# EAGLE design ScanMasterVCI (EAGLE 9.5.2)

## Sheet 1 of 2: IC, Power, Connectors
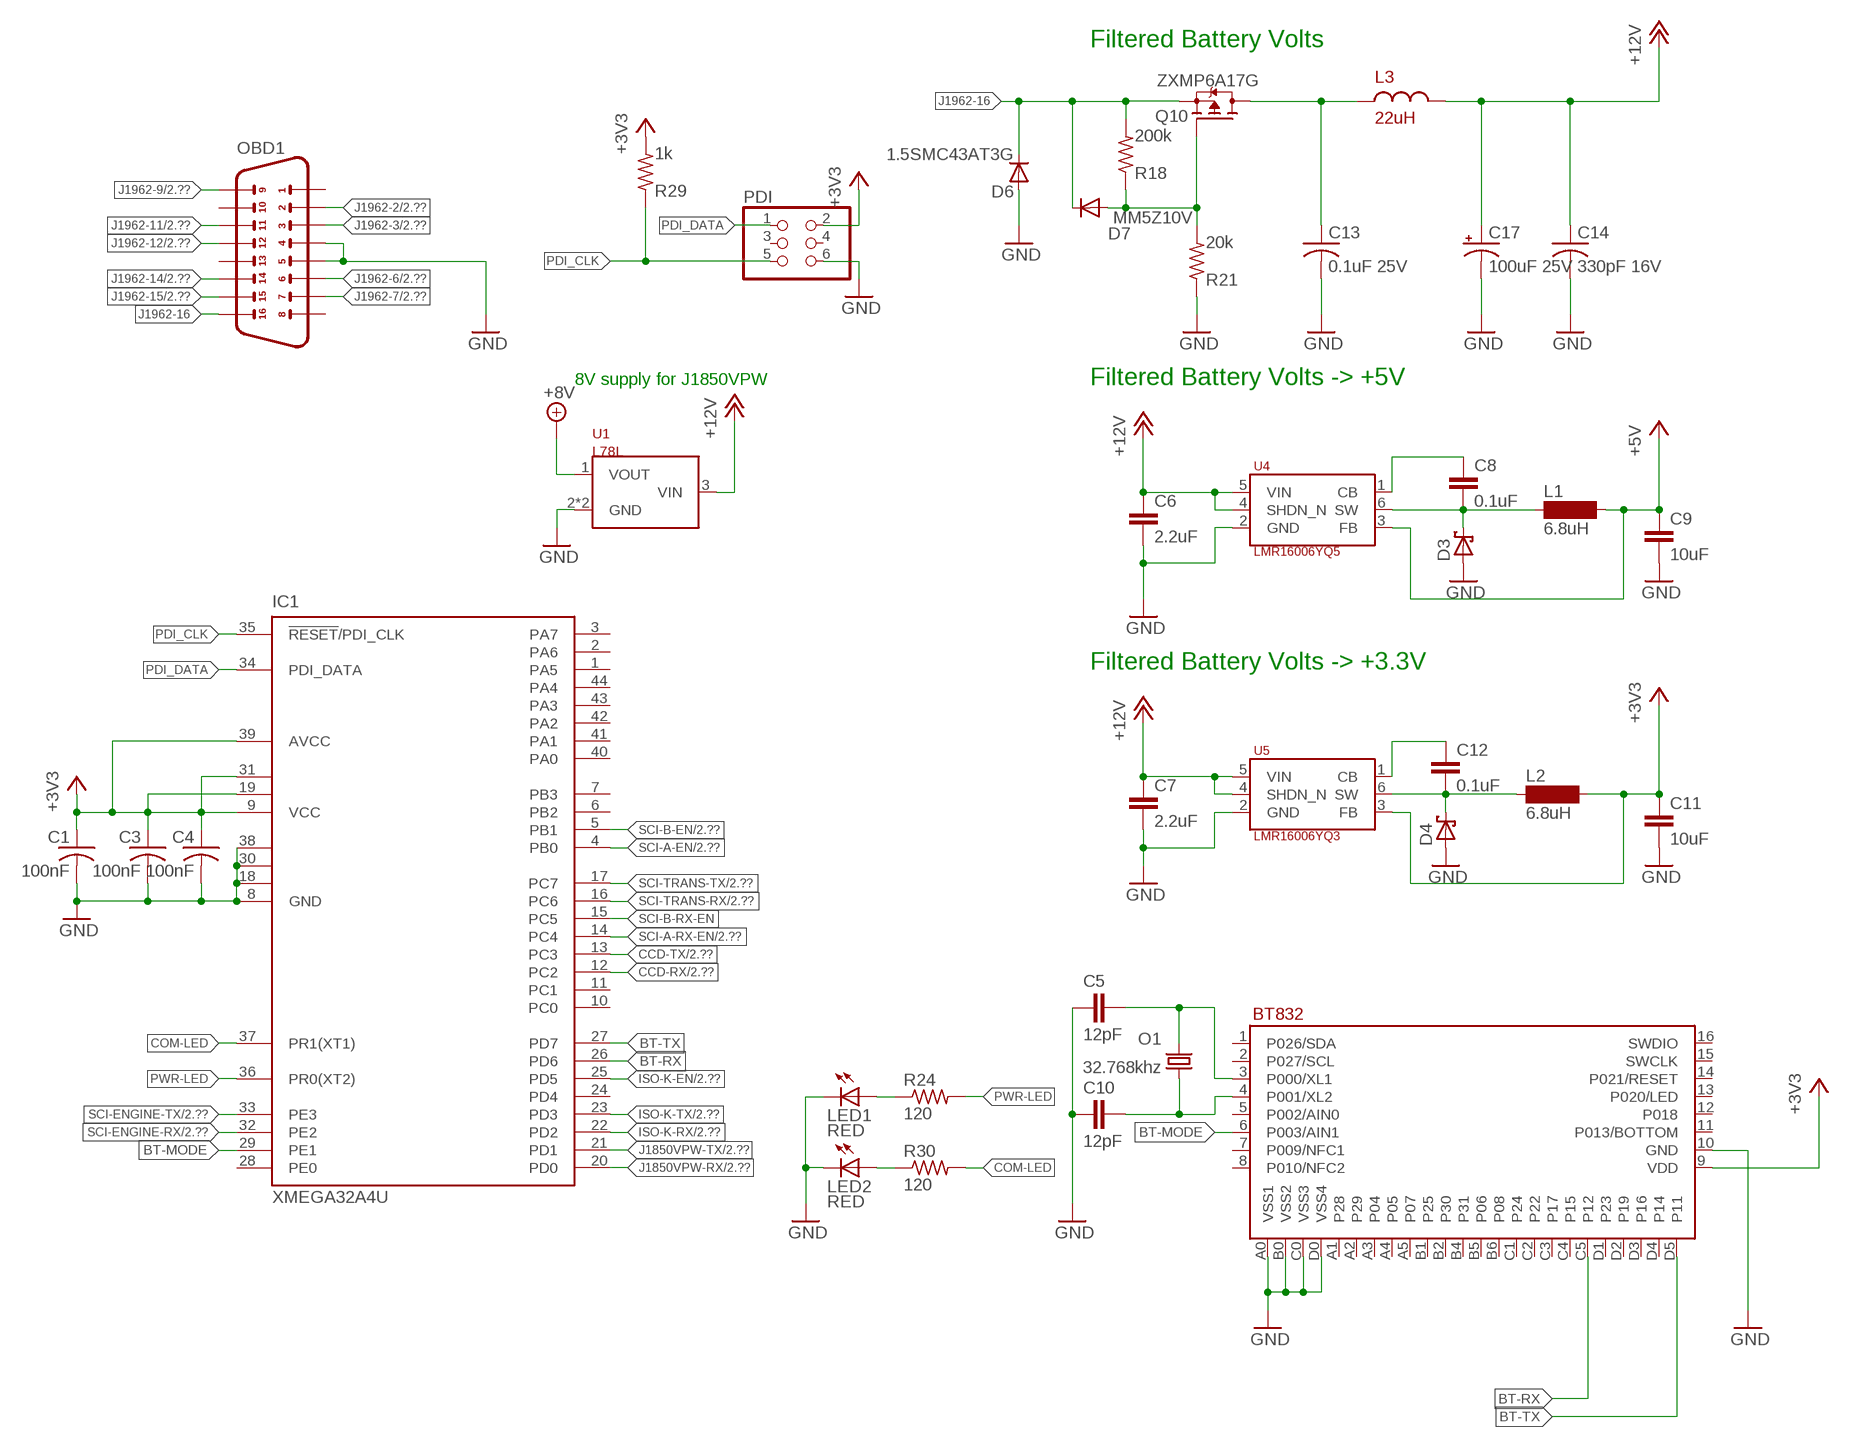
[diagram p0: schematic, sheet 1]

### Parts
C1  100nF  C-USC0402  [C0402]
C3  100nF  C-USC0402  [C0402]
C4  100nF  C-USC0402  [C0402]
C5  12pF  12PF-0603-50V-5%  [0603]
C6  2.2uF  2.2UF-1206-50V-10%  [1206]
C7  2.2uF  2.2UF-1206-50V-10%  [1206]
C8  0.1uF  0.1UF-0603-25V-(+80/-20%)  [0603]
C9  10uF  10UF-0603-6.3V-20%  [0603]
C10  12pF  12PF-0603-50V-5%  [0603]
C11  10uF  10UF-0603-6.3V-20%  [0603]
C12  0.1uF  0.1UF-0603-25V-(+80/-20%)  [0603]
C13  0.1uF 25V  C-USC0603  [C0603]
C14  330pF 16V  C-USC0603  [C0603]
C17  100uF 25V  100UF-POLAR-RADIAL-2.5MM-25V-20%  [CPOL-RADIAL-2.5MM-6.5MM]
D3  SM5817PL  [SOD123FL]
D4  SM5817PL  [SOD123FL]
D6  1.5SMC43AT3G  DIODE-SMC  [SMC]
D7  MM5Z10V  DIODE-SOD523  [SOD523]
IC1  XMEGA32A4U  XMEGA16A4M1  [MLF44-TH]
L1  6.8uH  SM-1206  [SM-1206]
L2  6.8uH  SM-1206  [SM-1206]
L3  22uH  INDUCTOR  [L0603]
LED1  RED  LEDCHIP-LED0603  [CHIP-LED0603]
LED2  RED  LEDCHIP-LED0603  [CHIP-LED0603]
O1  32.768khz  SER4103  [FC-135]
OBD1  OBD2_OBD2_90  [OBD2]
PDI  PINHD-2X3  [2X03]
Q10  ZXMP6A17G  [SOT223]
R18  200k  R-US_R0603  [R0603]
R21  20k  R-US_R0603  [R0603]
R24  120  R-US_R0603  [R0603]
R29  1k  R-US_R0603  [R0603]
R30  120  R-US_R0603  [R0603]
U1  L78L  [SOT89]
U4  LMR16006YQ5  LMR16006Y  [SOT6]
U5  LMR16006YQ3  LMR16006Y  [SOT6]
U6  BT832A  [BT832A]

### Nets
+3V3 [+3.3v]: C1.1 C3.1 C4.1 C11.1 IC1.9(VCC) IC1.19(VCC1) IC1.31(VCC2) IC1.39(AVCC) L2.2 PDI.2 R29.2 U5.3(FB) U6.9(VDD) ; also sheet 2
+5V [+5v]: C9.1 L1.2 U4.3(FB) ; also sheet 2
+8V [+3.3v]: U1.1(VOUT) ; also sheet 2
+12V [+12v]: C6.1 C7.1 C14.1 C17.1(+) L3.2 U1.3(VIN) U4.4(SHDN_N) U4.5(VIN) U5.4(SHDN_N) U5.5(VIN) ; also sheet 2
BT-MODE: IC1.29(PE1) U6.6(P003/AIN1)
BT-RX: IC1.26(PD6) U6.C5(P12)
BT-TX: IC1.27(PD7) U6.D5(P11)
CCD-RX: IC1.12(PC2) ; also sheet 2
CCD-TX: IC1.13(PC3) ; also sheet 2
COM-LED: IC1.37(PR1(XT1)) R30.2
GND [+12v]: C1.2 C3.2 C4.2 C5.1 C6.2 C7.2 C9.2 C10.1 C11.2 C13.2 C14.2 C17.2(-) D3.A D4.A D6.A IC1.8(GND) IC1.18(GND1) IC1.30(GND2) IC1.38(GND3) LED1.C LED2.C OBD1.4 OBD1.5 PDI.6 R21.1 U1.2(GND) U1.2@1(GND) U4.2(GND) U5.2(GND) U6.10(GND) U6.A0(VSS1) U6.B0(VSS2) U6.C0(VSS3) U6.D0(VSS4) ; also sheet 2
ISO-K-EN: IC1.25(PD5) ; also sheet 2
ISO-K-RX: IC1.22(PD2) ; also sheet 2
ISO-K-TX: IC1.23(PD3) ; also sheet 2
J1850VPW-RX: IC1.20(PD0) ; also sheet 2
J1850VPW-TX: IC1.21(PD1) ; also sheet 2
J1962-2: OBD1.2 ; also sheet 2
J1962-3: OBD1.3 ; also sheet 2
J1962-6: OBD1.6 ; also sheet 2
J1962-7: OBD1.7 ; also sheet 2
J1962-9: OBD1.9 ; also sheet 2
J1962-11: OBD1.11 ; also sheet 2
J1962-12: OBD1.12 ; also sheet 2
J1962-14: OBD1.14 ; also sheet 2
J1962-15: OBD1.15 ; also sheet 2
J1962-16 [+12v]: D6.C D7.C OBD1.16 Q10.3(S) R18.2
N$2: LED1.A R24.1
N$3: C8.1 U4.1(CB)
N$7: C8.2 D3.C L1.1 U4.6(SW)
N$9: C12.2 D4.C L2.1 U5.6(SW)
N$12: C12.1 U5.1(CB)
N$13: C5.2 O1.2 U6.3(P000/XL1)
N$18 [+12v]: C13.1 L3.1 Q10.2(D) Q10.4(D)
N$20 [+12v]: D7.A Q10.1(G) R18.1 R21.2
N$24: C10.2 O1.1 U6.4(P001/XL2)
N$27: LED2.A R30.1
PDI_CLK: IC1.35(!RESET!/PDI_CLK) PDI.5 R29.1
PDI_DATA: IC1.34(PDI_DATA) PDI.1
PWR-LED: IC1.36(PR0(XT2)) R24.2
SCI-A-EN: IC1.4(PB0) ; also sheet 2
SCI-A-RX-EN: IC1.14(PC4) ; also sheet 2
SCI-B-EN: IC1.5(PB1) ; also sheet 2
SCI-B-RX-EN: IC1.15(PC5)
SCI-ENGINE-RX: IC1.32(PE2) ; also sheet 2
SCI-ENGINE-TX: IC1.33(PE3) ; also sheet 2
SCI-TRANS-RX: IC1.16(PC6) ; also sheet 2
SCI-TRANS-TX: IC1.17(PC7) ; also sheet 2
Unconnected: IC1.1(PA5) IC1.2(PA6) IC1.3(PA7) IC1.6(PB2) IC1.7(PB3) IC1.10(PC0) IC1.11(PC1) IC1.24(PD4) IC1.28(PE0) IC1.40(PA0) IC1.41(PA1) IC1.42(PA2) IC1.43(PA3) IC1.44(PA4) OBD1.1 OBD1.8 OBD1.10 OBD1.13 PDI.3 PDI.4 U6.1(P026/SDA) U6.2(P027/SCL) U6.5(P002/AIN0) U6.7(P009/NFC1) U6.8(P010/NFC2) U6.11(P013/BOTTOM) U6.12(P018) U6.13(P020/LED) U6.14(P021/RESET) U6.15(SWCLK) U6.16(SWDIO) U6.A1(P28) U6.A2(P29) U6.A3(P04) U6.A4(P05) U6.A5(P07) U6.B1(P25) U6.B2(P30) U6.B4(P31) U6.B5(P06) U6.B6(P08) U6.C1(P24) U6.C2(P22) U6.C3(P17) U6.C4(P15) U6.D1(P23) U6.D2(P19) U6.D3(P16) U6.D4(P14)

### Notes on the sheet
- Filtered Battery Volts
- 8V supply for J1850VPW | Filtered Battery Volts -> +5V
- Filtered Battery Volts -> +3.3V

## Sheet 2 of 2: Bus Connections, Mux
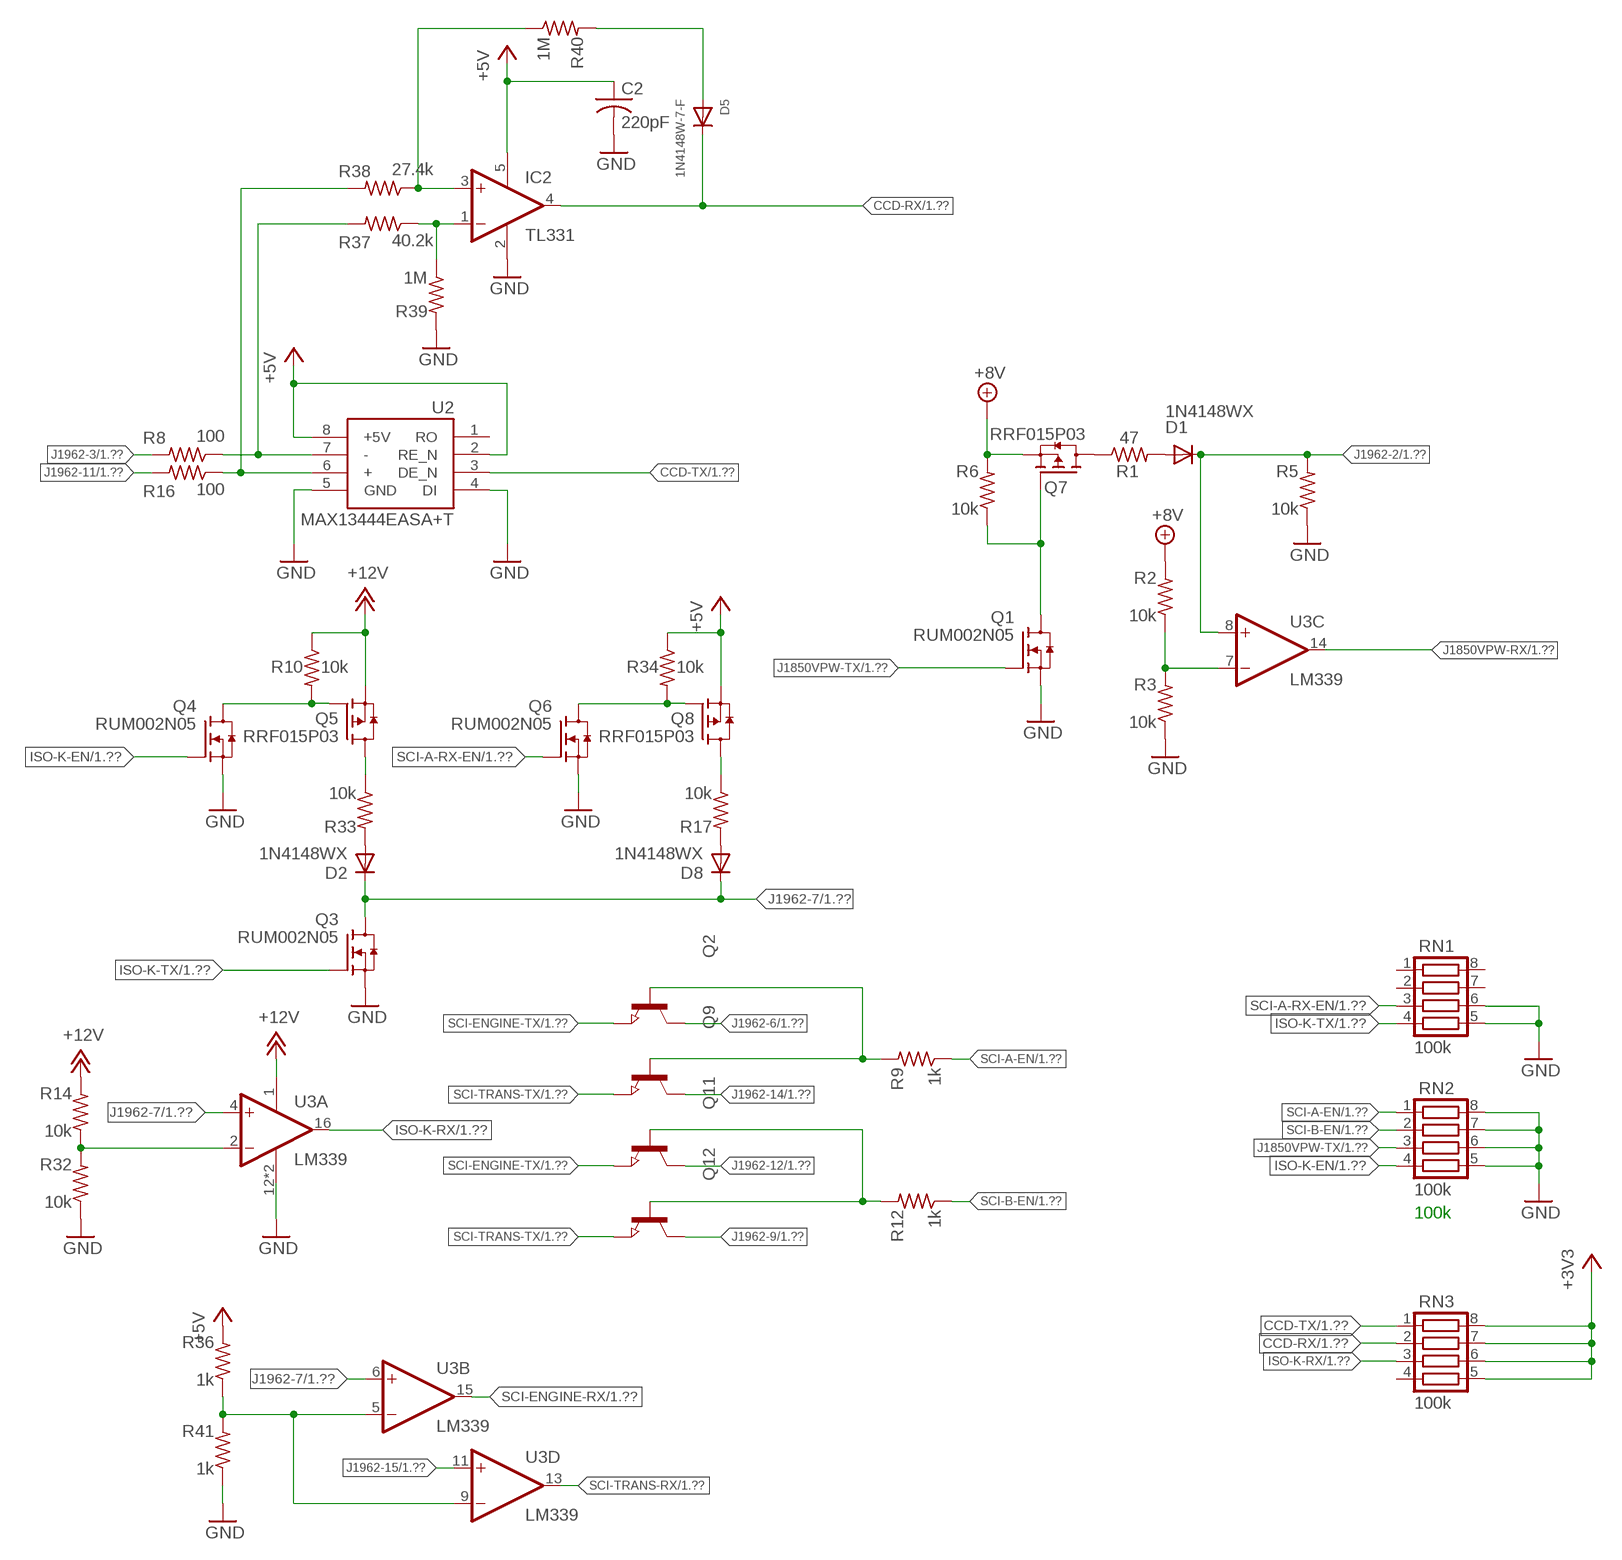
[diagram p1: schematic, sheet 2]

### Parts
C2  220pF  C-USC0603  [C0603]
D1  1N4148WX  DIODE-SOD323-R  [SOD323-R]
D2  1N4148WX  DIODE-SOD323-R  [SOD323-R]
D5  1N4148W-7-F  [SOD123FL]
D8  1N4148WX  DIODE-SOD323-R  [SOD323-R]
IC2  TL331  [DBV-R-PDSO-G5]
Q1  RUM002N05  [EMT3]
Q2  NPN-TRANSISTOR_SOT23  [SOT23]
Q3  RUM002N05  [EMT3]
Q4  RUM002N05  [EMT3]
Q5  RRF015P03  [SOT323]
Q6  RUM002N05  [EMT3]
Q7  RRF015P03  [SOT323]
Q8  RRF015P03  [SOT323]
Q9  NPN-TRANSISTOR_SOT23  [SOT23]
Q11  NPN-TRANSISTOR_SOT23  [SOT23]
Q12  NPN-TRANSISTOR_SOT23  [SOT23]
R1  47  R-US_R0603  [R0603]
R2  10k  R-US_R0603  [R0603]
R3  10k  R-US_R0603  [R0603]
R5  10k  R-US_R0603  [R0603]
R6  10k  R-US_R0603  [R0603]
R8  100  R-US_R0603  [R0603]
R9  1k  R-US_R0603  [R0603]
R10  10k  R-US_R0603  [R0603]
R12  1k  R-US_R0603  [R0603]
R14  10k  R-US_R0603  [R0603]
R16  100  R-US_R0603  [R0603]
R17  10k  R-US_R0603  [R0603]
R32  10k  R-US_R0603  [R0603]
R33  10k  R-US_R0603  [R0603]
R34  10k  R-US_R0603  [R0603]
R36  1k  R-US_R0603  [R0603]
R37  40.2k  R-US_R0603  [R0603]
R38  27.4k  R-US_R0603  [R0603]
R39  1M  R-US_R0603  [R0603]
R40  1M  R-US_R0603  [R0603]
R41  1k  R-US_R0603  [R0603]
RN1  100k  CTS742C083  [CTS742C083]
RN2  100k  CTS742C083  [CTS742C083]
RN3  100k  CTS742C083  [CTS742C083]
U2  MAX13444EASA+T  MAX13444EASA+SMD  [SO08]
U3  LM339  [QFN16]

### Nets
+3V3 [+3.3v]: RN3.5 RN3.6 RN3.7 RN3.8 ; also sheet 1
+5V [+5v]: C2.1 IC2.5(V+) Q8.2(S) R34.1 R36.2 U2.2(RE_N) U2.8(+5V) ; also sheet 1
+8V [+3.3v]: Q7.2(S) R2.2 R6.2 ; also sheet 1
+12V [+12v]: Q5.2(S) R10.1 R14.2 U3.1(A:V+) ; also sheet 1
CCD-RX: D5.C IC2.4(OUT) RN3.2 ; also sheet 1
CCD-TX: RN3.1 U2.3(DE_N) ; also sheet 1
GND [+12v]: C2.2 IC2.2(GND) Q1.2(S) Q3.2(S) Q4.2(S) Q6.2(S) R3.1 R5.1 R32.1 R39.2 R41.1 RN1.5 RN1.6 RN2.5 RN2.6 RN2.7 RN2.8 U2.4(DI) U2.5(GND) U3.12(A:V-) U3.PAD(A:V-) ; also sheet 1
ISO-K-EN: Q4.1(G) RN2.4 ; also sheet 1
ISO-K-RX: RN3.3 U3.16(A:OUT) ; also sheet 1
ISO-K-TX: Q3.1(G) RN1.4 ; also sheet 1
J1850VPW-RX: U3.14(C:OUT) ; also sheet 1
J1850VPW-TX: Q1.1(G) RN2.3 ; also sheet 1
J1962-2: D1.C R5.2 U3.8(C:+IN) ; also sheet 1
J1962-3: R8.2 ; also sheet 1
J1962-6: Q2.3(C) ; also sheet 1
J1962-7: D2.C D8.C Q3.3(D) U3.4(A:+IN) U3.6(B:+IN) ; also sheet 1
J1962-9: Q12.3(C) ; also sheet 1
J1962-11: R16.2 ; also sheet 1
J1962-12: Q11.3(C) ; also sheet 1
J1962-14: Q9.3(C) ; also sheet 1
J1962-15: U3.11(D:+IN) ; also sheet 1
N$1: Q2.1(B) Q9.1(B) R9.2
N$4: Q4.3(D) Q5.1(G) R10.2
N$5: Q11.1(B) Q12.1(B) R12.2
N$6: R36.1 R41.2 U3.5(B:-IN) U3.9(D:-IN)
N$8: R14.1 R32.2 U3.2(A:-IN)
N$10: Q7.3(D) R1.1
N$11: D2.A R33.2
N$21: D8.A R17.2
N$22: Q5.3(D) R33.1
N$23: Q6.3(D) Q8.1(G) R34.2
N$26: Q1.3(D) Q7.1(G) R6.1
N$30: D1.A R1.2
N$31: Q8.3(D) R17.1
N$33: R16.1 R38.2 U2.6(+)
N$34: IC2.1(-IN) R37.1 R39.1
N$35: IC2.3(+IN) R38.1 R40.1
N$36: D5.A R40.2
N$37: R2.1 R3.2 U3.7(C:-IN)
N$39: R8.1 R37.2 U2.7(-)
SCI-A-EN: R9.1 RN2.1 ; also sheet 1
SCI-A-RX-EN: Q6.1(G) RN1.3 ; also sheet 1
SCI-B-EN: R12.1 RN2.2 ; also sheet 1
SCI-ENGINE-RX: U3.15(B:OUT) ; also sheet 1
SCI-ENGINE-TX: Q2.2(E) Q11.2(E) ; also sheet 1
SCI-TRANS-RX: U3.13(D:OUT) ; also sheet 1
SCI-TRANS-TX: Q9.2(E) Q12.2(E) ; also sheet 1
Unconnected: RN1.1 RN1.2 RN1.7 RN1.8 RN3.4 U2.1(RO)

### Notes on the sheet
- 100k

## Library data of the parts
C1-C4 C13 C14 = adafruit:C-US: CAPACITOR, American symbol
C5 C10 = SparkFun-Capacitors:12PF: 12pF ceramic capacitors A capacitor is a passive two-terminal electrical component used to store electrical energy temporarily in an electric field.; PROD_ID: CAP-09137
C6 C7 = SparkFun-Capacitors:2.2UF: 2.2µF ceramic capacitors A capacitor is a passive two-terminal electrical component used to store electrical energy temporarily in an electric field.; PROD_ID: CAP-10009
C8 C12 = SparkFun-Capacitors:0.1UF: 0.1µF ceramic capacitors A capacitor is a passive two-terminal electrical component used to store electrical energy temporarily in an electric field.; PROD_ID: CAP-00810
C9 C11 = SparkFun-Capacitors:10UF: 10.0µF ceramic capacitors A capacitor is a passive two-terminal electrical component used to store electrical energy temporarily in an electric field.; PROD_ID: CAP-11015
C17 = SparkFun-Capacitors:100UF-POLAR: 100µF polarized capacitors A capacitor is a passive two-terminal electrical component used to store electrical energy temporarily in an electric field.; PROD_ID: CAP-08439; VALUE: 100uF
D1 D2 D6-D8 = diode:DIODE-: DIODE
D3 D4 = customics:SM5817PL
D5 = customics:1N4148W-7-F: SURFACE MOUNT FAST SWITCHING DIODE Source: https://www.diodes.com/assets/Datasheets/ds30086.pdf
IC1 = atmel:XMEGA16A4: MICROCONTROLLER Features High-performance, Low-power 8/16-bit AVR XMEGA Microcontroller Non-Volatile Program and Data Memories - 16 KB - 128 KB of In-System Self-Programmable Flash - 4 KB - 8 KB Boot Code Section with Independent Lock Bits - 1 KB - 2 KB EEPROM - 2 KB - 8 KB Internal SRAM Peripheral Features - Four-channel DMA Controller with support for external requests - Eight-channel Event System - Five 16-bit Timer/Counters Three Timer/Counters with 4 Output Compare or Input Capture channels Two Timer/Counters with 2 Output Compare or Input Capture channels High-Resolution Extensions on all Timer/Counters Advanced Waveform Extension on one Timer/Counter - Five USARTs IrDA Extension on one USART - Two Two-Wire Interfaces with dual address match (I2C and SMBus compatible) - Two SPIs (Serial Peripheral Interfaces) peripherals - AES and DES Crypto Engine - 16-bit Real Time Counter with Separate Oscillator - One Twelve-channel, 12-bit, 2 Msps Analog to Digital Converter - One Two-channel, 12-bit, 1 Msps Digital to Analog Converter - Two Analog Comparators with Window compare function - External Interrupts on all General Purpose I/O pins - Programmable Watchdog Timer with Separate On-chip Ultra Low Power Oscillator Special Microcontroller Features - Power-on Reset and Programmable Brown-out Detection - Internal and External Clock Options with PLL - Programmable Multi-level Interrupt Controller - Sleep Modes: Idle, Power-down, Standby, Power-save, Extended Standby - Advanced Programming, Test and Debugging Interfaces PDI (Program and Debug Interface) for programming, test and debugging I/O and Packages - 34 Programmable I/O Lines - 44 - lead TQFP - 44 - pad VQFN/QFN - 49 - ball VFBGA Operating Voltage - 1.6 - 3.6V Speed performance - 0 - 12 MHz @ 1.6 - 3.6V - 0 - 32 MHz @ 2.7 - 3.6V Drawn by Dipl.-Ing. (FH) Robert Siegler Created: 27.05.09; OC_FARNELL: unknown; OC_NEWARK: unknown
IC2 = linear:TL331: SINGLE DIFFERENTIAL COMPARATOR Source: Data sheet <http://www.ti.com/lit/ds/symlink/tl331-q1.pdf>
L1 L2 = inductor-neosid:SM-1206: INDUCTOR SMD chip inductor; OC_FARNELL: unknown; OC_NEWARK: unknown
L3 = customics:INDUCTOR: Generic Inductor in SMD
LED1 LED2 = led:LED: LED OSRAM: - CHIPLED LG R971, LG N971, LY N971, LG Q971, LY Q971, LO R971, LY R971 LH N974, LH R974 LS Q976, LO Q976, LY Q976 LO Q996 - Hyper CHIPLED LW Q18S LB Q993, LB Q99A, LB R99A - SideLED LS A670, LO A670, LY A670, LG A670, LP A670 LB A673, LV A673, LT A673, LW A673 LH A674 LY A675 LS A676, LA A676, LO A676, LY A676, LW A676 LS A679, LY A679, LG A679 - Hyper Micro SIDELED® LS Y876, LA Y876, LO Y876, LY Y876 LT Y87S - SmartLED LW L88C, LW L88S LB L89C, LB L89S, LG L890 LS L89K, LO L89K, LY L89K LS L896, LA L896, LO L896, LY L896 - TOPLED LS T670, LO T670, LY T670, LG T670, LP T670 LSG T670, LSP T670, LSY T670, LOP T670, LYG T670 LG T671, LOG T671, LSG T671 LB T673, LV T673, LT T673, LW T673 LH T674 LS T676, LA T676, LO T676, LY T676, LB T676, LH T676, LSB T676, LW T676 LB T67C, LV T67C, LT T67C, LS T67K, LO T67K, LY T67K, LW E67C LS E67B, LA E67B, LO E67B, LY E67B, LB E67C, LV E67C, LT E67C LW T67C LS T679, LY T679, LG T679 LS T770, LO T770, LY T770, LG T770, LP T770 LB T773, LV T773, LT T773, LW T773 LH T774 LS E675, LA E675, LY E675, LS T675 LS T776, LA T776, LO T776, LY T776, LB T776 LHGB T686 LT T68C, LB T68C - Hyper Mini TOPLED® LB M676 - Mini TOPLED Santana® LG M470 LS M47K, LO M47K, LY M47K Source: http://www.osram.convergy.de LUXEON: - LUMILED® LXK2-PW12-R00, LXK2-PW12-S00, LXK2-PW14-U00, LXK2-PW14-V00 LXK2-PM12-R00, LXK2-PM12-S00, LXK2-PM14-U00 LXK2-PE12-Q00, LXK2-PE12-R00, LXK2-PE12-S00, LXK2-PE14-T00, LXK2-PE14-U00 LXK2-PB12-K00, LXK2-PB12-L00, LXK2-PB12-M00, LXK2-PB14-N00, LXK2-PB14-P00, LXK2-PB14-Q00 LXK2-PR12-L00, LXK2-PR12-M00, LXK2-PR14-Q00, LXK2-PR14-R00 LXK2-PD12-Q00, LXK2-PD12-R00, LXK2-PD12-S00 LXK2-PH12-R00, LXK2-PH12-S00 LXK2-PL12-P00, LXK2-PL12-Q00, LXK2-PL12-R00 Source: www.luxeon.com KINGBRIGHT: KA-3528ASYC Source: www.kingbright.com
O1 = customics:SER4103
OBD1 = customics:OBD2_
PDI = pinhead:PINHD-2X3: PIN HEADER
Q1 Q3 Q4 Q6 = customics:RUM002N05
Q2 Q9 Q11 Q12 = semicon-smd-ipc:NPN-TRANSISTOR_: NPN TRANSISTOR
Q5 Q7 Q8 = customics:RRF015P03
Q10 = customics:ZXMP6A17G
R1-R3 R5 R6 R8-R10 R12 R14 R16-R18 R21 R29 R32-R34 R36-R41 = adafruit:R-US_: RESISTOR, American symbol
R24 R30 = resistor:R-US_: RESISTOR, American symbol
RN1-RN3 = resistor-net:CTS742C083: Chip Resistor Array 4 Single Resistor Source: http://www.ctscorp.com/components/Datasheets/CTSChipArrayDs.pdf; OC_FARNELL: unknown; OC_NEWARK: unknown
U1 = customics:L78L: Positive voltage regulators Source: http://www.mouser.com/ds/2/389/l78l-974102.pdf
U2 = customics:MAX13444EASA+: ±15kV ESD-Protected, ±80V Fault-Protected, Fail-Safe RS-485/J1708 Transceivers Source http://www.mouser.com/ds/2/256/MAX13442E-MAX13444E-103611.pdf; PROD_ID: IC-09714; VALUE: 24LC256
U3 = customics:LM339: Low-power quad voltage comparators Data Sheet <https://www.st.com/content/ccc/resource/technical/document/datasheet/bf/7e/d7/a4/67/86/4e/89/CD00000460.pdf/files/CD00000460.pdf/jcr:content/translations/en.CD00000460.pdf>
U4 U5 = customics:LMR16006Y: LMR16006Y-Q1 SIMPLE SWITCHER® Buck Regulators With High-Efficiency ECO Mode http://www.ti.com/lit/ds/symlink/lmr16006y-q1.pdf
U6 = customics:BT832A

## Net classes
0 default: width 0.152 mm, drill 0.305 mm, clearance 0.152 mm
1 +12v: width 0.305 mm, drill 0.305 mm, clearance 0.152 mm
2 +3.3v: width 0.254 mm, drill 0.305 mm, clearance 0.152 mm
3 +5v: width 0.254 mm, drill 0.305 mm, clearance 0.152 mm

## Board
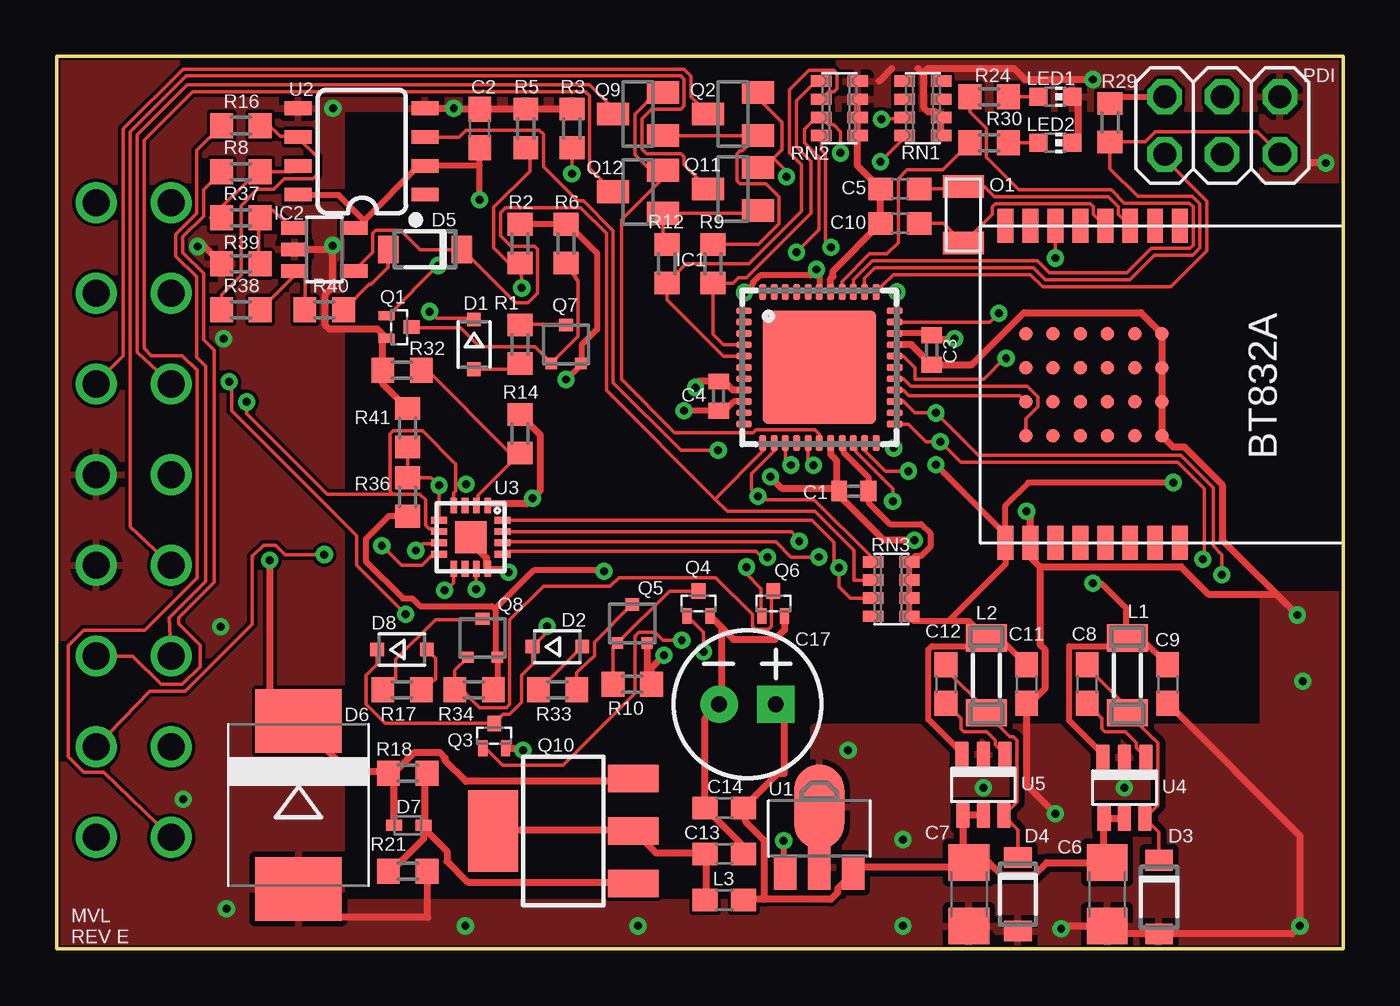
[diagram p2: board, top side]
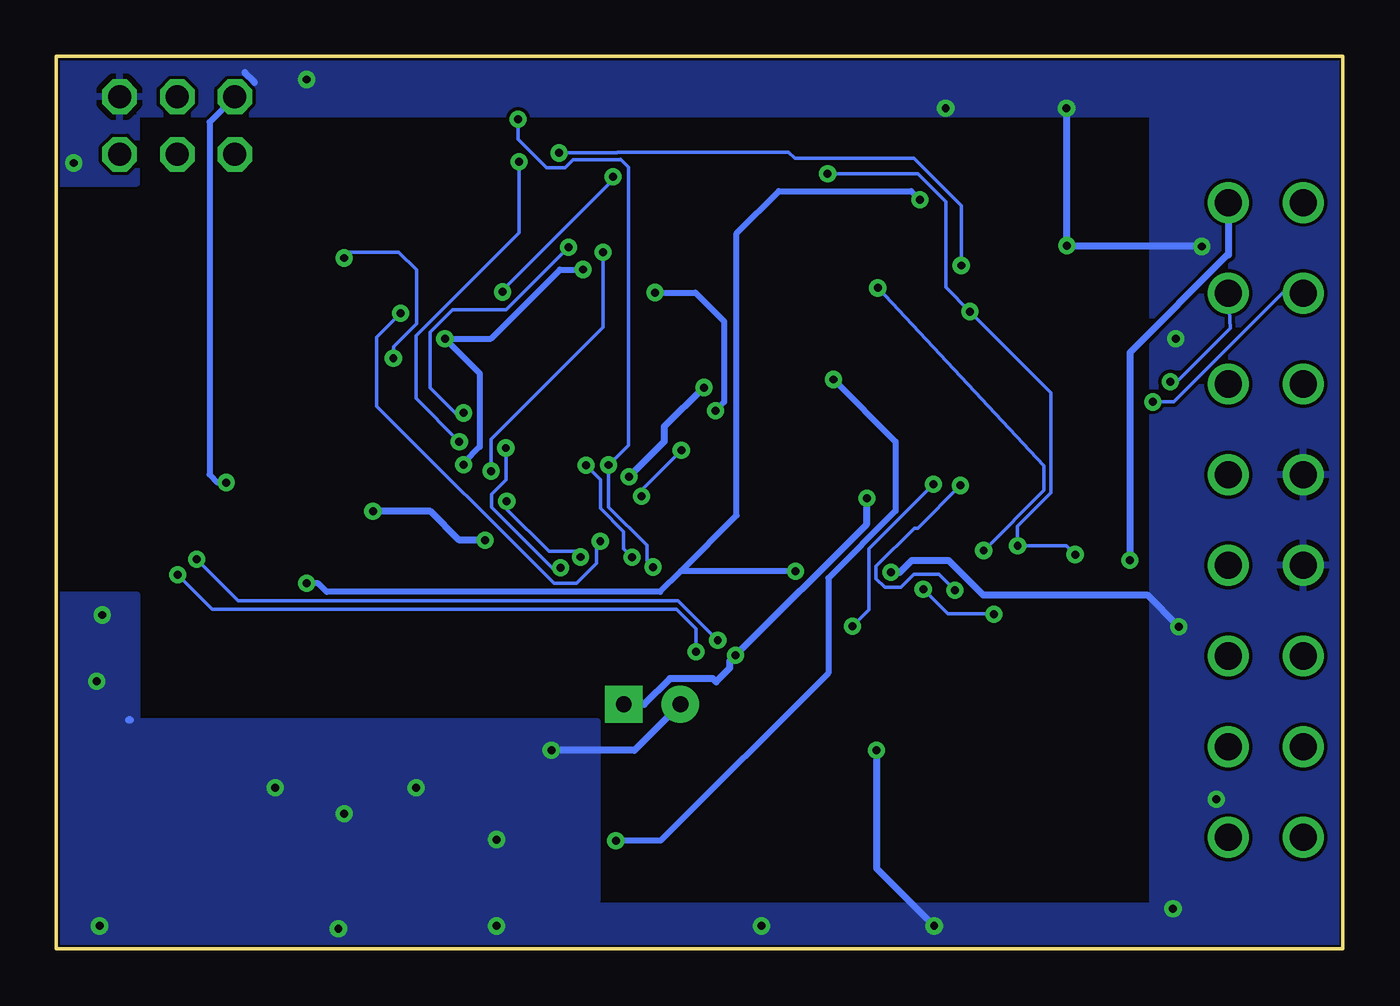
[diagram p3: board, bottom side, seen from below]

Size 56.76 x 39.36 mm. Coordinates in mm from the lower left corner, seen from the top.
Outline: 0,0 56.76,0 56.76,39.36 0,39.36 0,0
Copper layers (1*16): Top 0.035mm / dielectric 1.5mm / Bottom 0.035mm
Design rules "default *": minimum track width 6mil, minimum drill 0.35mm, track to track 6mil, track to pad 6mil, pad to pad 6mil, via to via 8mil, smd to smd 6mil, copper to edge 6mil, drill to drill 6mil, minimum pad ring 10mil, minimum via ring 8mil, stop-mask expansion 4mil, vias tented up to drill 0mil, thermal gap 10mil
Milling: 4 lines

### Footprints (pad centres in the part's own frame; a part is rotated, then mirrored left to right if it is on the bottom)
C0402 = smd 0.7 x 0.9: 1 -0.65,0; 2 0.65,0
C0603 = smd 1.1 x 1: 1 -0.85,0; 2 0.85,0
0603 = smd 1.1 x 1: 1 -0.85,0; 2 0.85,0
1206 = smd 1.6 x 1.8: 1 -1.4,0; 2 1.4,0
CPOL-RADIAL-2.5MM-6.5MM = drill 0.7 pad 1.651 square: 1 1.25,0 | drill 0.7 pad 1.651: 2 -1.25,0
SOD323-R = smd 0.6 x 0.6: A 1.1,0; C -1.1,0
SOD123FL = smd 0.91 x 1.22: A 1.625,0; C -1.625,0
SMC = smd 2.8 x 3.8: A 3.7,0; C -3.7,0
SOD523 = smd 0.7 x 0.5: A 0.7,0; C -0.6,0
MLF44-TH = smd 0.7 x 0.3: 1 -3.325,2.5; 2 -3.325,2; 3 -3.325,1.5; 4 -3.325,1; 5 -3.325,0.5; 6 -3.325,0; 7 -3.325,-0.5; 8 -3.325,-1; 9 -3.325,-1.5; 10 -3.325,-2; 11 -3.325,-2.5; 23 3.325,-2.5; 24 3.325,-2; 25 3.325,-1.5; 26 3.325,-1; 27 3.325,-0.5; 28 3.325,0; 29 3.325,0.5; 30 3.325,1; 31 3.325,1.5; 32 3.325,2; 33 3.325,2.5 | smd 0.3 x 0.7: 12 -2.5,-3.325; 13 -2,-3.325; 14 -1.5,-3.325; 15 -1,-3.325; 16 -0.5,-3.325; 17 0,-3.325; 18 0.5,-3.325; 19 1,-3.325; 20 1.5,-3.325; 21 2,-3.325; 22 2.5,-3.325; 34 2.5,3.325; 35 2,3.325; 36 1.5,3.325; 37 1,3.325; 38 0.5,3.325; 39 0,3.325; 40 -0.5,3.325; 41 -1,3.325; 42 -1.5,3.325; 43 -2,3.325; 44 -2.5,3.325 | smd 5 x 5: TH 0,0
DBV-R-PDSO-G5 = smd 0.6 x 1.2: 1 -0.95,-1.306; 2 0,-1.306; 3 0.95,-1.306; 4 0.95,1.306; 5 -0.95,1.306
SM-1206 = smd 1.2 x 1.8: 1 -1.65,0; 2 1.65,0
L0603 = smd 1.1 x 1: 1 -0.85,0; 2 0.85,0
CHIP-LED0603 = smd 0.8 x 0.8: A 0,-0.75; C 0,0.75
FC-135 = smd 1 x 1.8: 1 -1.25,0; 2 1.25,0
OBD2 = drill 1.2: 1 -14,1.65; 2 -10,1.65; 3 -6,1.65; 4 -2,1.65; 5 2,1.65; 6 6,1.65; 7 10,1.65; 8 14,1.65; 9 -14,-1.65; 10 -10,-1.65; 11 -6,-1.65; 12 -2,-1.65; 13 2,-1.65; 14 6,-1.65; 15 10,-1.65; 16 14,-1.65
2X03 = drill 1.016 octagon: 1 -2.54,-1.27; 2 -2.54,1.27; 3 0,-1.27; 4 0,1.27; 5 2.54,-1.27; 6 2.54,1.27
EMT3 = smd 0.4 x 0.7: 1 -0.5,-0.55; 2 0.5,-0.55 | smd 0.6 x 0.7: 3 0,0.55
SOT23 = smd 1 x 1.4: 1 -0.95,-1.1; 2 0.95,-1.1; 3 0,1.1
SOT323 = smd 0.5 x 0.5: 1 -0.65,-0.85; 2 0.65,-0.85 | smd 0.6 x 0.55: 3 0,0.85
SOT223 = smd 1.219 x 2.235: 1 -2.311,-3.099; 2 0,-3.099; 3 2.311,-3.099 | smd 3.6 x 2.2: 4 0,3.099
R0603 = smd 1 x 1.1: 1 -0.85,0; 2 0.85,0
CTS742C083 = smd 0.5 x 0.9: 1 -1.2,-0.8; 2 -0.4,-0.8; 3 0.4,-0.8; 4 1.2,-0.8; 5 1.2,0.8; 6 0.4,0.8; 7 -0.4,0.8; 8 -1.2,0.8
SOT89 = smd 1 x 1.5: 1 -1.499,-1.981; 3 1.499,-1.981 | smd 1 x 2: 2 0,-1.727 | smd 2.2 x 3.7: 2@1 0,0.94
SO08 = smd 0.6 x 1.2: 1 -1.905,-2.8; 2 -0.635,-2.8; 3 0.635,-2.8; 4 1.905,-2.8; 5 1.905,2.8; 6 0.635,2.8; 7 -0.635,2.8; 8 -1.905,2.8
QFN16 = smd 0.7 x 0.3: 1 -1.4,0.75; 2 -1.4,0.25; 3 -1.4,-0.25; 4 -1.4,-0.75; 9 1.4,-0.75; 10 1.4,-0.25; 11 1.4,0.25; 12 1.4,0.75 | smd 0.3 x 0.7: 5 -0.75,-1.4; 6 -0.25,-1.4; 7 0.25,-1.4; 8 0.75,-1.4; 13 0.75,1.4; 14 0.25,1.4; 15 -0.25,1.4; 16 -0.75,1.4 | smd 1.4 x 1.4: PAD 0,0
SOT6 = smd 1.1 x 0.6: 1 -1.35,0.95; 2 -1.35,0; 3 -1.35,-0.95; 4 1.35,-0.9; 5 1.35,0; 6 1.35,0.9
BT832A = smd 1.5 x 0.7: 1 -7,0.8; 2 -7,-0.3; 3 -7,-1.4; 4 -7,-2.5; 5 -7,-3.6; 6 -7,-4.7; 7 -7,-5.8; 8 -7,-6.9; 9 6.97,-6.9; 10 6.97,-5.8; 11 6.97,-4.7; 12 6.97,-3.6; 13 6.97,-2.5; 14 6.97,-1.4; 15 6.97,-0.3; 16 6.97,0.8 | smd 0.6 x 0.6: A0 -2.25,0; A1 -2.25,-1.2; A2 -2.25,-2.4; A3 -2.25,-3.6; A4 -2.25,-4.8; A5 -2.25,-6; B0 -0.75,0; B1 -0.75,-1.2; B2 -0.75,-2.4; B4 -0.75,-3.6; B5 -0.75,-4.8; B6 -0.75,-6; C0 0.75,0; C1 0.75,-1.2; C2 0.75,-2.4; C3 0.75,-3.6; C4 0.75,-4.8; C5 0.75,-6; D0 2.25,0; D1 2.25,-1.2; D2 2.25,-2.4; D3 2.25,-3.6; D4 2.25,-4.8; D5 2.25,-6

### Placement (x,y rotation side)
C1  35.18,20.19 180 top
C2  18.67,36.2 90 top
C3  38.61,26.42 270 top
C4  29.21,24.38 90 top
C5  37.21,33.53 0 top
C6  46.35,2.41 270 top
C7  40.26,2.41 270 top
C8  45.47,11.68 90 top
C9  49.02,11.68 270 top
C10  37.21,32 0 top
C11  42.8,11.68 270 top
C12  39.24,11.68 90 top
C13  29.46,4.19 0 top
C14  29.46,6.22 180 top
C17  30.48,10.79 0 top
D1  18.41,26.67 270 top
D2  22.1,13.34 0 top
D3  48.64,2.29 270 top
D4  42.42,2.41 270 top
D5  16.26,30.86 180 top
D6  10.67,6.35 270 top
D7  15.49,5.46 0 top
D8  15.24,13.21 0 top
IC1  33.66,25.65 0 top
IC2  11.81,30.86 270 top
L1  47.24,12.06 90 top
L2  41.02,12.06 90 top
L3  29.46,2.16 0 top
LED1  44.07,37.59 270 top
LED2  44.07,35.56 270 top
O1  40.01,32.38 90 top
OBD1  3.4,18.92 90 top
PDI  51.44,36.32 0 top
Q1  15.11,27.43 270 top
Q2  29.84,36.83 90 top
Q3  19.3,9.4 0 top
Q4  28.32,15.24 0 top
Q5  25.4,14.35 0 top
Q6  31.62,15.24 0 top
Q7  22.48,26.67 0 top
Q8  18.8,13.72 0 top
Q9  25.65,36.83 90 top
Q10  22.35,5.21 90 top
Q11  29.84,33.53 90 top
Q12  25.65,33.4 90 top
R1  20.45,26.67 270 top
R2  20.45,31.11 90 top
R3  20.7,36.2 270 top
R5  22.73,36.2 270 top
R6  22.48,31.11 90 top
R8  8.13,34.29 180 top
R9  28.96,30.23 90 top
R10  25.4,11.68 180 top
R12  26.92,30.23 90 top
R14  20.45,22.73 90 top
R16  8.13,36.32 180 top
R17  15.24,11.43 0 top
R18  15.49,7.75 180 top
R21  15.49,3.43 180 top
R24  41.15,37.59 180 top
R29  46.48,36.45 90 top
R30  41.15,35.56 180 top
R32  15.24,25.53 0 top
R33  22.1,11.43 180 top
R34  18.41,11.43 180 top
R36  15.49,19.94 270 top
R37  8.13,32.26 180 top
R38  8.13,28.19 180 top
R39  8.13,30.23 180 top
R40  11.81,28.19 0 top
R41  15.49,22.99 270 top
RN1  38.23,37.08 270 top
RN2  34.54,37.08 270 top
RN3  36.83,15.88 270 top
U1  33.66,5.33 0 top
U2  13.46,35.18 90 top
U3  18.27,18.16 270 top
U4  47.12,7.11 270 top
U5  40.89,7.24 270 top
U6  48.77,24.89 270 top

### Tracks (layer width: path | path; a pad name or v marks a point on that pad's centre or on a via)
+3V3  (via drill 0.35)
  Top 0.254: R29.2 46.52,37.59 PDI.2 | 39.37,14.48 37.83,14.48 RN3.5 RN3.6 RN3.7 RN3.8 37.88,17.33 38.14,17.33 38.55,17.74 38.55,18.33 38.14,18.74 36.77,18.74 35.83,19.68 C1.1 35.83,20.8 34.73,21.91 34.73,22.26 IC1.19 | U6.9 41.87,19.57 42.87,20.57 v49.28,20.57 | IC1.31 38.52,27.15 C3.1 38.75,26.92 v39.62,26.92 | IC1.9 29.88,24.15 29.46,23.73 C4.1 27.7,23.73 v27.69,23.75 | IC1.39 33.66,29.84 v33.53,29.97 33.27,29.72 31.04,29.72 30.73,29.4 30.73,29.33 v30.35,28.96 | v38.81,21.36 41.87,18.29 U6.9 | U5.3 39.94,8.65 38.46,10.13 38.46,13.2 38.63,13.36 40.67,13.36 L2.2 | L2.2 41.62,13.71 C11.1 | U6.9 41.87,16.98 39.37,14.48 | 39.37,14.48 40.26,14.48 L2.2
  Bottom 0.254: v49.28,20.57 49.66,20.57 50.01,20.93 50.01,36.47 PDI.2 | v33.53,29.97 34.54,29.97 37.59,26.92 v39.62,26.92 38.09,25.39 38.09,22.15 38.81,21.43 v38.81,21.36 | v30.35,28.96 28.57,28.96 27.3,27.69 27.3,24.13 v27.69,23.75
+5V  (via drill 0.35)
  Top 0.254: 13.56,32.13 15.98,34.54 U2.2 16.26,34.57 18.67,34.57 C2.1 v18.67,33.05 | 13.56,32.13 13.26,31.83 13.13,31.83 IC2.5 | U2.8 10.69,33.25 12.45,33.25 13.56,32.13 | R34.1 19.27,11.52 19.48,11.57 19.48,12.85 Q8.2 19.53,12.91 19.38,13.06 19.38,14.96 | 19.38,14.96 19.38,14.99 19.36,15.01 21.05,16.7 24.12,16.7 v24.16,16.66 | 19.38,14.96 19.21,15.12 16.03,15.12 15.69,15.47 15.28,15.47 13.64,17.11 13.64,18.07 14.66,19.09 R36.2 | U4.3 46.17,8.59 44.69,10.07 44.69,13.36 46.89,13.36 47.18,13.65 | 47.18,13.65 L1.2 47.84,13.71 C9.1 | v45.72,16.13 46.1,16.13 47.18,15.05 47.18,13.65
  Bottom 0.254: 29.21,16.66 26.75,19.13 26.75,31.57 24.89,33.43 19.05,33.43 v18.67,33.05 | 29.21,16.66 30.12,15.75 44.83,15.75 45.21,16.13 v45.72,16.13 | v24.16,16.66 29.21,16.66
+8V  (via drill 0.35)
  Top 0.254: R2.2 R6.2 22.63,31.9 23.85,30.68 23.85,27.33 23.16,26.64 23.16,25.88 Q7.2 23.09,25.73 v22.48,25.12 | v32.08,4.78 32.08,3.4 U1.1
  Bottom 0.254: v32.08,4.78 30.1,4.78 22.71,12.17 22.71,16.36 19.74,19.33 19.74,22.38 v22.48,25.12
+12V  (via drill 0.35)
  Top 0.305: 31.24,2.18 30.33,2.18 L3.2 | C17.1 32.11,10.42 32.11,7.75 31.84,7.75 C14.1 30.33,6.22 30.4,6.15 30.4,5.61 31.24,4.78 31.24,2.18 | Q5.2 26.05,11.68 R10.1 26.25,12.41 v26.8,12.95 | 31.24,2.18 34.16,2.18 34.46,2.48 34.46,2.66 U1.3 35.41,3.61 40.05,3.61 C7.1 | U3.1 19.05,19.63 20.75,19.63 v21.01,19.89 21.34,20.22 21.34,22.68 20.5,23.52 R14.2 | U5.5 U5.4 39.99,4.08 C7.1 | C7.1 41.15,3.81 41.68,3.28 43.15,3.28 43.69,3.81 C6.1 46.22,3.95 U4.4 U4.5
  Bottom 0.305: C17.1 30.83,10.79 29.7,11.93 27.8,11.93 27.66,11.79 27.05,12.39 27.05,12.7 v26.8,12.95 21.01,18.75 v21.01,19.89
BT-MODE  (via drill 0.35)
  Top 0.152: v41.9,26.06 41.87,26.09 40.92,25.14 37.87,25.14 37.87,25.65 37.36,26.15 IC1.29 | U6.6 v44.07,30.48
  Bottom 0.152: v44.07,30.48 43.81,30.73 41.66,30.73 40.88,29.96 40.88,27.59 41.9,26.57 v41.9,26.06
BT-RX
  Top 0.152: U6.C5 42.51,24.4 37.62,24.4 37.36,24.65 IC1.26
BT-TX
  Top 0.152: IC1.27 37.36,25.15 37.69,24.82 42.84,24.82 43.3,24.36 43.3,23.92 42.77,23.39 U6.D5
CCD-RX
  Top 0.152: RN3.2 35.18,16.27 35.18,17.59 33.46,19.3 29.59,19.3 29.05,19.84 | IC2.4 13.95,30.74 13.95,31.57 14.08,31.7 15.18,31.7 16.05,30.84 17.83,30.84 D5.C 20.25,28.5 20.8,28.5 21.23,28.93 21.23,30.86 21.09,30.99 20.05,30.99 19.58,31.45 19.58,32.48 19.8,32.69 23.12,32.69 24.26,31.56 24.26,24.64 29.05,19.84 | IC1.12 31.16,21.95 29.05,19.84
CCD-TX  (via drill 0.35)
  Top 0.152: RN3.1 35.9,17.07 35.9,17.34 33.41,19.83 31.04,19.83 31.04,19.88 v30.95,19.97 30.66,20.26 30.66,20.95 31.66,21.95 IC1.13 | U2.3 17.77,35.81 18.07,36.12 21.3,36.12 21.48,35.94 21.48,34.51 22.99,33 23.25,33 24.56,31.69 24.56,24.97 27.54,21.99 v29.19,21.99
  Bottom 0.152: v30.95,19.97 30.95,20.24 v29.19,21.99
COM-LED
  Top 0.152: R30.2 39.1,34.36 37.52,34.36 37.14,33.98 37.14,31.16 36.64,30.66 35.87,30.66 34.65,29.44 IC1.37
GND  (via drill 0.35)
  Top 0.305: C13.2 30.31,4.52 C14.2 28.61,10.18 C17.2 29.33,10.89 29.33,14.18 Q4.2 29.86,13.65 31.7,13.65 32.12,14.07 Q6.2 | R21.1 16.34,1.44 16.38,1.4 11.92,1.4 D6.A | RN2.7 RN2.6 RN2.5 35.34,34.55 C5.1 C10.1 34.26,29.91 34.26,29.67 34.16,29.56 IC1.38 | RN1.5 RN1.6 38.78,36.93 38.45,36.93 38.27,37.11 38.27,38.66 38.45,38.84 42.23,38.84 42.72,38.35 v45.72,38.35 | 38.18,38.66 38,38.84 | 36.85,38.84 36.3,38.28 | U1.2 33.68,3.63 33.68,6.22 U1.2@1 | v19.94,16.61 19.81,16.74 19.05,16.74 U3.12 18.98,16.81 18.98,17.24 18.27,17.95 U3.PAD | LED2.C 45.06,35.8 45.06,37.35 LED1.C | 43.39,16.87 42.97,17.29 U6.10 42.97,19.07 42.8,19.23 v42.8,19.3 | Q3.2 20.57,8.85 v20.57,8.76 | R41.1 14.39,24.94 R32.1 14.39,26.76 Q1.2 14.16,27.34 12.04,27.34 11.86,27.52 11.86,28.87 12.18,29.19 v12.18,31.03 12.01,30.86 IC2.2 | R5.1 R3.1 C2.2 17.57,37.05 v17.53,37.08 U2.4 | IC1.18 34.16,21.82 34.41,21.57 34.41,20.19 | 34.41,20.19 C1.2 34.53,20.01 36.5,18.03 v37.85,18.03 | v56.01,34.67 55.37,34.67 | IC1.30 37.72,26.65 C3.2 40.39,25.77 42.69,28.07 47.84,28.07 U6.A0 U6.B0 U6.C0 U6.D0 49.26,22.15 49.76,22.15 51.44,20.48 51.44,18.03 v54.74,14.73 53.82,15.65 50.83,15.65 49.61,16.87 43.39,16.87 | IC1.8 29.84,24.65 29.46,25.03 C4.2 28.32,25.03 28.19,24.91 v28.19,24.77 | v31.5,20.83 31.99,20.33 34.27,20.33 34.41,20.19 | R39.2 6.52,30.99 v6.22,30.99 | C11.2 42.8,10.67 | 42.8,10.67 42.8,7.24 v44.07,5.97 | C9.2 54.86,4.99 v54.86,1.02 54.51,0.66 D3.A 46.71,0.66 C6.2 44.45,1.01 v44.32,0.89 | 42.8,10.67 43.6,11.47 43.6,13.21 43.39,13.43 43.39,16.87
  Bottom 0.305: C17.2 31.26,8.76 v34.92,8.76 | 53.49,10.11 53.59,10.11 | v20.57,8.76 20.57,3.56 v18.03,1.02 | v19.94,16.61 19.55,16.61 19.02,17.14 17.4,17.14 15.88,15.62 8.64,15.62 v7.24,14.22 | 48.02,38.23 48.45,38.66 | v31.5,20.83 29.94,22.38 29.94,23.04 28.22,24.77 v28.19,24.77 | v37.85,18.03 38.99,18.03 40.26,19.3 v42.8,19.3 | v12.19,37.08 12.18,37.07 v12.18,31.03 12.13,30.99 v6.22,30.99
  other vias: 7.37,26.92 5.59,6.6 7.49,1.78 25.65,1.02 37.34,1.02 37.34,4.83 40.89,7.11 47.12,7.11 54.99,11.81
  pour Top (isolate 0.254): 33.78,2.03 53.47,2.03 53.47,9.78 33.4,9.78 33.4,6.99 33.78,6.6
  pour Top: 0.13,0 53.85,0 53.85,2.03 0.13,2.03
  pour Top: 53.72,39.24 0,39.24 0,37.08 53.34,37.08 53.72,36.7
  pour Top: -0.01,39.12 0.13,2.03 12.57,2.03 12.57,39.12
  pour Bottom: 32.89,2.16 32.89,10.03 53.34,10.03 53.47,10.16 53.47,2.16
  pour Bottom: 0.13,-0.13 56.77,-0.13 56.77,1.91 0.13,1.91
  pour Bottom: 56.77,1.69 56.77,15.62 53.21,15.62 53.21,1.69
  pour Bottom: 53.72,39.24 0,39.24 0,36.83 53.47,36.83 53.72,36.58
  pour Bottom: 0,37.21 0,1.91 8.38,1.91 8.38,37.21
  pour Top: 53.21,0.25 56.77,0.25 56.77,15.62 53.21,15.62
  pour Top: 53.21,33.91 53.21,39.24 56.77,39.24 56.77,33.91
  pour Bottom: 53.21,33.78 53.21,39.12 56.64,39.12 56.64,33.78
ISO-K-EN  (via drill 0.35)
  Top 0.152: v51.41,16.51 51.41,17.4 51.03,17.78 51.03,20.34 49.6,21.77 40.67,21.77 v38.8,23.64 37.87,23.64 37.36,24.15 IC1.25 | Q4.1 28.55,13.96 v28.55,13.11 | v34.17,30.95 33.93,31.18 33.93,35.05 33.74,35.24 RN2.4
  Bottom 0.152: v28.55,13.11 28.55,14.12 29.41,14.99 49.89,14.99 v51.41,16.51 | v34.17,30.95 36.92,28.19 39.28,28.19 40.28,27.2 40.28,24.75 39.18,23.64 v38.8,23.64
ISO-K-RX  (via drill 0.35)
  Top 0.152: RN3.3 35.02,15.47 34.52,15.98 v34.52,16.82 34.29,17.04 34.29,17.94 33.32,18.91 U3.16 | IC1.22 36.7,22.33 v36.93,22.1
  Bottom 0.152: v36.93,22.1 36.93,20.7 37.57,20.07 37.57,19.48 34.9,16.82 v34.52,16.82
ISO-K-TX  (via drill 0.35)
  Top 0.152: v50.57,17.2 50.63,17.26 50.63,20.31 49.48,21.47 39.9,21.47 v38.99,22.38 38.35,22.38 37.58,23.15 IC1.23 | Q3.1 18.93,8.85 19.67,8.11 22.34,8.11 25.52,11.28 25.52,13.8 25.7,13.98 26.39,13.98 26.76,13.61 v27.58,13.61 | RN1.4 37.43,35.8 v36.35,34.72
  Bottom 0.152: v27.58,13.61 29.34,15.37 48.74,15.37 v50.57,17.2 | v38.99,22.38 40.89,24.28 40.89,27.05 36.35,31.6 v36.35,34.72
J1850VPW-RX  (via drill 0.35)
  Top 0.152: U3.14 19.74,17.96 31.74,17.96 32.41,17.29 v33.64,17.29 | IC1.20 35.28,22.21 35.28,21.93 36.89,20.31 v36.89,19.75
  Bottom 0.152: v36.89,19.75 36.89,19.4 35.03,17.54 33.89,17.54 v33.64,17.29
J1850VPW-TX  (via drill 0.35)
  Top 0.152: v16.84,30.15 14.63,27.94 Q1.1 | v32.64,30.73 33.63,31.73 33.63,34.92 32.99,35.56 32.99,36.17 33.45,36.63 33.68,36.63 RN2.3 34.06,36.36 34.29,36.36 34.59,36.06 v34.59,35.11 | v37.59,21.08 36.57,21.08 35.66,22 IC1.21
  Bottom 0.152: v16.84,30.15 16.84,32.79 18.92,34.87 24.18,34.87 24.46,35.15 32,35.15 32.04,35.11 v34.59,35.11 | v32.64,30.73 32.64,27.43 37.59,22.48 v37.59,21.08
J1962-2  (via drill 0.35)
  Top 0.152: v16.46,28.12 16.76,27.81 18.36,27.81 D1.C | R5.2 v22.73,34.19 | U3.8 16.62,17.41 16.12,16.92 15.21,16.92 v14.35,17.78 | OBD1.2 4.1,11.36 5.67,11.36 8.64,14.33 8.64,17.31 9.13,17.8 9.67,17.8 10.07,17.4 v11.81,17.4
  Bottom 0.152: v22.73,34.19 18.75,34.19 17.53,32.97 17.53,29.18 v16.46,28.12 12.88,24.54 12.88,20.12 14.35,18.64 v14.35,17.78 12.19,17.78 v11.81,17.4
J1962-3
  Top 0.152: OBD1.3 3.36,12.92 4.61,11.67 5.55,11.67 6.33,12.46 6.33,13.39 5.38,14.34 5.38,14.61 6.95,16.17 6.95,26.41 6.48,26.88 6.48,28.32 6.48,28.33 6.48,29.8 5.57,30.72 5.57,31.41 6.48,32.33 6.48,33.49 R8.2
J1962-6
  Top 0.152: Q2.3 27.99,37.59 27.99,38.5 27.68,38.81 5.58,38.81 2.94,36.18 2.94,26.16 1.7,24.92 OBD1.6
J1962-7  (via drill 0.35)
  Top 0.152: 17.6,20.5 17.6,21.41 17.59,21.41 16.14,22.87 14.85,22.87 14.71,22.73 14.71,20.19 14.85,20.06 | 17.6,20.5 17.6,20.19 17.53,20.12 17.53,19.58 U3.4 | 17.6,20.5 v18.06,20.5 | U3.6 16.75,18.54 16.43,18.54 16.27,18.69 16.27,19.81 16.02,20.06 14.85,20.06 | 14.85,20.06 11.93,20.06 8.38,23.61 v8.38,24.13 | D8.C 14.14,12.55 13.66,12.07 13.66,10.79 14.5,9.95 Q3.3 19.7,10.35 19.99,10.35 20.52,10.88 20.52,12.07 21,12.55 D2.C 21.64,13.98 v21.64,14.23
  Bottom 0.152: v18.06,20.5 20.9,17.65 20.9,14.97 v21.64,14.23 | OBD1.7 2.67,28.92 7.47,24.13 v8.38,24.13
J1962-9
  Top 0.152: Q12.3 23.51,34.44 23.51,37.64 23.33,37.82 6.01,37.82 3.86,35.67 3.86,26.5 4.17,26.18 5.55,26.18 6.21,25.52 6.21,16.37 3.89,14.05 1.19,14.05 0.51,13.38 0.51,8.47 1.19,7.79 2.08,7.79 OBD1.9
J1962-11
  Top 0.152: OBD1.11 4.96,14.61 6.58,16.23 6.58,25.71 6.17,26.11 6.17,28.45 6.18,28.46 6.18,29.39 6.17,29.4 6.17,29.64 5.26,30.55 5.26,31.54 6.18,32.46 6.18,35.22 R16.2
J1962-12
  Top 0.152: Q11.3 27.68,34.59 27.68,34.95 27.55,35.08 26.03,35.08 25.82,35.28 25.82,36.62 26.26,37.05 27.55,37.05 27.68,37.19 27.68,38.38 27.55,38.51 5.71,38.51 3.25,36.05 3.25,18.63 OBD1.12
J1962-14
  Top 0.152: Q9.3 24.55,37.08 23.51,38.13 5.76,38.13 3.55,35.92 3.55,26.33 OBD1.14
J1962-15  (via drill 0.35)
  Top 0.152: v18.52,15.88 U3.11 | v15.39,14.76 13.23,16.92 13.23,18.24 7.72,23.75 7.72,24.91 v7.62,25.02
  Bottom 0.152: v15.39,14.76 15.42,14.78 17.42,14.78 v18.52,15.88 | v7.62,25.02 7.33,25.02 4.97,27.37 OBD1.15
J1962-16  (via drill 0.35)
  Top 0.305: D7.C 14.86,5.46 14.86,7.59 14.71,7.75 R18.2 | R18.2 14.55,7.82 12.88,7.82 10.67,10.03 D6.C 9.9,10.82 9.4,11.38 v9.4,17.14 | Q10.3 25.32,7.39 18.06,7.39 17.15,8.3 17.15,8.42 16.91,8.66 15.77,8.66 14.86,7.75 R18.2
  Bottom 0.305: OBD1.16 5.05,30.62 5.09,30.62 9.4,26.31 v9.4,17.14
N$1
  Top 0.152: R9.2 30.97,31.08 31.87,31.98 31.87,33.17 31.3,33.75 30.15,33.75 30.02,33.88 30.02,35.07 30.15,35.21 30.27,35.21 Q2.1 Q9.1
N$2
  Top 0.152: R24.1 LED1.A
N$3
  Top 0.152: C8.1 46.12,10.19 46.12,9.72 46.25,9.59 47.15,9.59 47.65,9.09 47.65,8.88 U4.1
N$4
  Top 0.152: R10.2 24.55,13.3 Q5.1 27.04,15.79 Q4.3
N$5
  Top 0.152: Q11.1 30.82,32.45 Q12.1 26.75,31.25 R12.2
N$6  (via drill 0.35)
  Top 0.152: R41.2 15.62,22.14 15.49,22.01 R36.1 16.53,20.79 v16.87,20.45 U3.5 | U3.9 17.52,16.15 17.2,15.83 v17.12,15.83
  Bottom 0.152: v16.87,20.45 18.75,18.57 18.91,18.57 20.6,16.88 20.6,16.34 20.21,15.95 19.5,15.95 18.92,16.53 17.83,16.53 v17.12,15.83
N$7
  Top 0.152: C8.2 45.47,12.45 47.24,10.67 L1.1 48.42,9.24 48.44,9.24 48.6,9.09 48.6,6.34 U4.6 48.64,5.14 D3.C
N$8
  Top 0.152: 20.23,21.65 20.42,21.84 R14.1 | 20.23,21.65 18.59,20.02 18.59,19.63 U3.2 | 20.23,21.65 16.03,25.86 16.03,25.54 16.07,25.53 R32.2
N$9
  Top 0.152: C12.2 39.24,12.32 41.02,10.54 L2.1 42.07,9.37 42.22,9.37 42.37,9.22 42.37,6.47 U5.6 42.42,5.26 D4.C
N$10
  Top 0.152: Q7.3 22.48,27.56 20.5,27.56 R1.1
N$11
  Top 0.152: D2.A 23.16,13.31 21.26,11.4 R33.2
N$12
  Top 0.152: U5.1 41.42,9.01 41.42,9.22 41.05,9.59 40.03,9.59 39.89,9.72 39.89,10.19 C12.1
N$13
  Top 0.152: C5.2 39.9,33.53 O1.2 40.91,33.63 41.37,33.17 46.41,33.17 46.85,32.74 46.85,32.41 U6.3
N$18
  Top 0.305: L3.1 28.65,2.18 28.65,4.17 C13.1 28.5,4.24 26.44,4.24 25.53,5.16 Q10.2 25.3,5.23 19.28,5.23 Q10.4
N$20
  Top 0.305: D7.A 16.23,5.46 16.23,7.67 16.31,7.75 R18.1 | D7.A 16.19,4.87 14.76,3.43 R21.2 | Q10.1 25.45,2.95 18.14,2.95 17.22,3.86 17.22,4.32 16.23,5.31 D7.A
N$21
  Top 0.152: D8.A 16.71,12.84 16.71,11.91 R17.2
N$22
  Top 0.152: R33.1 22.95,12.18 23.57,12.81 23.59,12.81 23.73,12.94 23.73,13.53 Q5.3
N$23
  Top 0.152: Q8.1 17.57,12.29 R34.2 17.89,11.43 18.67,10.65 19.86,10.65 19.99,10.79 19.99,14.52 21.48,16 24.43,16 24.81,16.38 29.08,16.38 30.69,14.77 30.69,14.24 30.83,14.11 31.42,14.11 31.55,14.24 31.55,15.72 Q6.3
N$24
  Top 0.152: C10.2 39.14,32 O1.1 41.29,32.42 41.29,32.74 41.42,32.87 45.61,32.87 45.75,32.74 45.75,32.41 U6.4
N$26
  Top 0.152: R6.1 23.01,29.45 23.01,27.03 21.87,25.88 Q7.1 21.79,25.88 21.11,26.57 18.67,26.57 17.83,27.41 15.7,27.41 Q1.3
N$27
  Top 0.152: R30.1 LED2.A
N$30
  Top 0.152: D1.A 18.44,25.58 20.19,25.58 20.42,25.81 R1.2
N$31
  Top 0.152: Q8.3 18.8,14.53 16.71,14.53 14.96,12.78 14.96,11.89 R17.1
N$33
  Top 0.152: 10.59,35.84 9.86,35.84 9.26,36.43 R16.1 | 10.59,35.84 U2.6 | R38.2 7.28,28.85 8.13,29.71 8.13,32.79 8.86,33.51 9.57,33.51 10.05,33.98 11.33,33.98 11.49,34.15 11.49,34.94 10.59,35.84
N$34
  Top 0.152: IC2.1 10.41,31.81 9.53,32.59 8.99,32.59 8.91,32.51 8.91,32.26 | 8.91,32.26 R37.1 | R39.1 8.91,30.29 8.91,32.26
N$35
  Top 0.152: R40.1 10.97,28.25 10.97,29.62 10.64,29.95 10.55,29.93 IC2.3 10.51,29.72 R38.1
N$36
  Top 0.152: R40.2 12.72,28.25 13.79,29.31 13.87,29.31 14.63,30.07 14.63,30.84 D5.A
N$37  (via drill 0.35)
  Top 0.152: v15.85,17.58 16.15,17.88 16.84,17.88 U3.7 | v20.52,29.16 20.5,30.23 R2.1 19.94,30.27 19.28,30.93 19.28,32.72 20.88,34.31 20.88,35.03 R3.2
  Bottom 0.152: v15.85,17.58 13.18,20.24 13.18,21.31 v20.52,29.16
N$39
  Top 0.152: R37.2 6.81,32.26 8.84,34.29 R8.1 10.41,34.29 U2.7
PDI_CLK
  Top 0.152: PDI.5 52.98,36.04 48.48,36.04 48.04,35.6 R29.1 46.48,34.42 47.71,33.2 50.12,33.2 50.45,32.86 50.45,30.92 50.14,30.61 48.44,30.61 47.35,29.52 43.63,29.52 43.1,30.05 36.12,30.05 35.66,29.59 IC1.35
PDI_DATA
  Top 0.152: PDI.1 48.9,34.85 50.76,32.99 50.76,30.8 49.17,29.21 43.51,29.21 42.98,29.74 36.92,29.74 36.43,29.25 IC1.34
PWR-LED
  Top 0.152: R24.2 40.3,36.93 41.03,36.2 41.03,34.92 42.47,33.48 46.53,33.48 47.12,32.89 49.99,32.89 50.15,32.74 50.15,31.05 50.01,30.91 48.31,30.91 47.22,29.82 43.8,29.82 43.27,30.35 35.99,30.35 35.16,29.52 IC1.36
SCI-A-EN
  Top 0.152: RN2.1 33.68,38.23 33.45,38.23 32.64,37.41 32.64,35.38 33.27,34.75 33.27,32.45 30.9,30.07 30.89,30.07 30.44,29.61 30.08,29.61 29.84,29.38 R9.1 28.96,27.11 29.42,26.65 IC1.4
SCI-A-RX-EN  (via drill 0.35)
  Top 0.152: Q6.1 31.09,14.76 31.09,15.9 30.44,16.55 v30.44,16.85 | v36.4,36.6 36.4,36.63 37.41,36.63 RN1.3 | v32.4,21.35 32.16,21.59 IC1.14
  Bottom 0.152: v36.4,36.6 36.4,35.71 35.14,34.46 34.32,34.46 33.97,34.81 31.91,34.81 31.87,34.85 31.52,34.49 31.52,22.22 v32.4,21.35 32.4,19.49 30.71,17.81 30.71,17.12 v30.44,16.85
SCI-B-EN
  Top 0.152: RN2.2 34.06,37.8 34.29,37.8 34.42,37.94 34.42,38.63 34.29,38.76 33.2,38.76 32.33,37.9 32.33,35.13 32.87,34.6 32.87,32.54 30.55,30.23 27.77,30.23 R12.1 26.92,28.65 29.42,26.15 IC1.5
SCI-ENGINE-RX  (via drill 0.35)
  Top 0.152: U3.15 19.74,18.41 32.42,18.41 32.77,18.07 v32.77,17.98 | IC1.32 41.18,27.65 v41.58,28.05 v41.58,28.04
  Bottom 0.152: v41.58,28.04 42.63,26.99 42.63,23.94 34.81,16.13 33.82,16.13 32.93,17.02 32.93,17.82 v32.77,17.98
SCI-ENGINE-TX  (via drill 0.35)
  Top 0.152: 31.24,34.49 30.96,34.49 Q11.2 31.23,34.48 31.24,34.49 | 31.64,34.89 32,35.26 32,36.47 30.96,37.52 Q2.2 | 31.64,34.89 31.24,34.49 | 31.64,34.89 32.21,34.31 v32.21,34.06 | v37.08,28.98 37.15,28.15 IC1.33
  Bottom 0.152: v32.21,34.06 32.21,33.93 37.08,29.06 v37.08,28.98
SCI-TRANS-RX  (via drill 0.35)
  Top 0.152: IC1.16 33.16,21.58 v33.4,21.34 | v31.37,17.27 31.11,17.27 30.85,17.54 19.79,17.54 U3.13
  Bottom 0.152: v33.4,21.34 32.77,20.7 32.77,19.43 31.75,18.41 31.75,17.65 v31.37,17.27
SCI-TRANS-TX
  Top 0.152: Q9.2 26.48,37.78 25.52,36.82 25.52,35.03 26.2,34.35 Q12.2 26.75,33.99 24.92,32.16 24.92,25.12 27.26,22.77 30.73,22.77 30.86,22.91 33.46,22.91 33.66,22.71 IC1.17

### Text on the board
tNames: MVL / REV E